# EasyEDA Pro project 第十二届蓝桥杯EDA国赛真题.eprj, schematic user
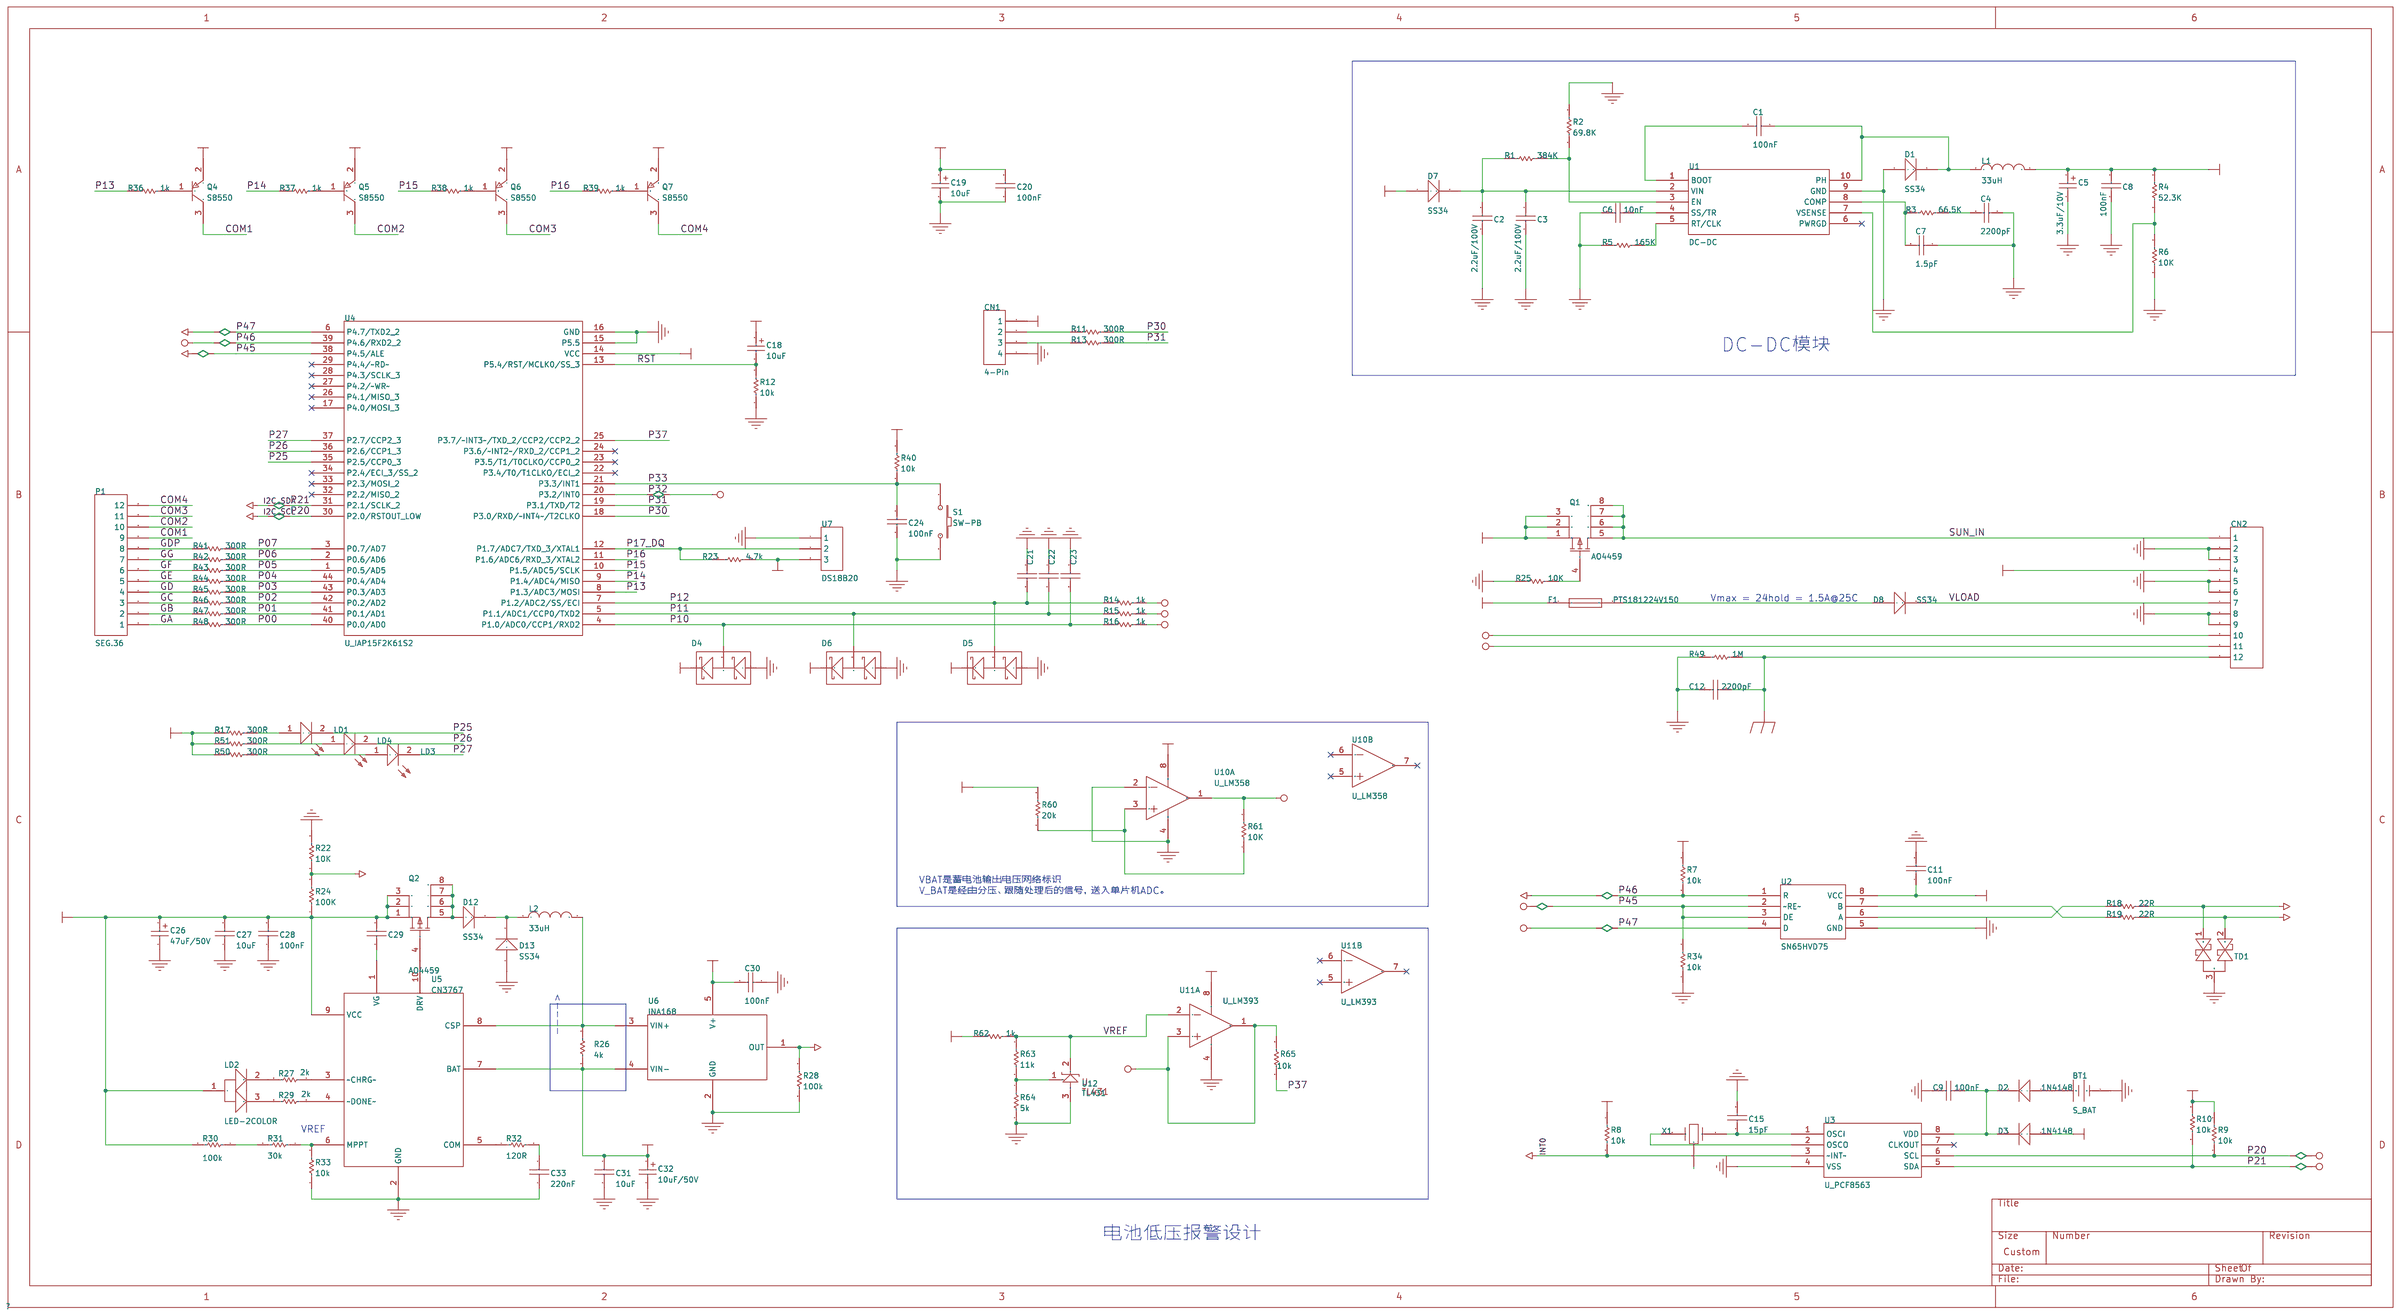
[diagram p0: schematic sheet]

## Parts
BT1  S_BAT  [S_BAT-CR1220]
C1  100nF  [C_C0805]
C2  2.2uF/100V  [C_C1812]
C3  2.2uF/100V  [C_C1812]
C4  2200pF  [C_C0805]
C5  47uF  [C_C1812]
C6  10nF  [C_C0805]
C7  1.5pF  [C_C0805]
C8  100nF  [C_C0805]
C9  100nF  [C_C0805]
C11  100nF  [C_C0805]
C12  2200pF  [C_CAP-10]
C15  15pF  [C_C0805]
C18  47uF  [C_C1206]
C19  47uF  [C_C1206]
C20  100nF  [C_C0805]
C21  100nF  [C_C0805]
C22  100nF  [C_C0805]
C23  100nF  [C_C0805]
C24  100nF  [C_C0805]
C26  47uF  [C_CAP-6X7]
C27  10uF  [C_C1206]
C28  100nF  [C_C0805]
C29  100nF  [C_C0805]
C30  100nF  [C_C0805]
C31  10uF  [C_C1206]
C32  47uF  [C_CAP-5X5]
C33  220nF  [C_C0805]
CN1  4-Pin  [SIP-4]
CN2  Header 12H  [SIP12-3.81]
D1  SS34  [D_DIO-SMA]
D2  1N4148  [D_DIO-SMT]
D3  1N4148  [D_DIO-SMT]
D4  BAT54S  [SOP-SOT23-3]
D5  BAT54S  [SOP-SOT23-3]
D6  BAT54S  [SOP-SOT23-3]
D7  SS34  [D_DIO-SMA]
D8  SS34  [D_DIO-SMA]
D12  SS34  [D_DIO-SMA]
D13  SS34  [D_DIO-SMA]
F1  PTS181224V150  [F_Fuse_1812]
L1  100uH  [L_L7X7X4]
L2  100uH  [L_L12x12]
LD1  Red  [D_LED-3MM]
LD2  LED-2COLOR  [共阳极双色LED]
LD3  Red  [D_LED-3MM]
LD4  Red  [D_LED-3MM]
P1  SEG.36  [D_SEG-0.56]
Q1  AO4459  [SOP-8]
Q2  AO4459  [SOP-8]
Q4  S8550  [SOP-SOT23-3]
Q5  S8550  [SOP-SOT23-3]
Q6  S8550  [SOP-SOT23-3]
Q7  S8550  [SOP-SOT23-3]
R1  1K  [R_R0805]
R2  1K  [R_R0805]
R3  1K  [R_R0805]
R4  1K  [R_R0805]
R5  1K  [R_R0805]
R6  1K  [R_R0805]
R7  1K  [R_R0805]
R8  1K  [R_R0805]
R9  1K  [R_R0805]
R10  1K  [R_R0805]
R11  1K  [R_R0805]
R12  1K  [R_R0805]
R13  1K  [R_R0805]
R14  1K  [R_R0805]
R15  1K  [R_R0805]
R16  1K  [R_R0805]
R17  1K  [R_R0805]
R18  1K  [R_R0805]
R19  1K  [R_R0805]
R22  1K  [R_R0805]
R23  1K  [R_R0805]
R24  1K  [R_R0805]
R25  1K  [R_R0805]
R26  1K  [R_R2512]
R27  1K  [R_R0805]
R28  1K  [R_R0805]
R29  1K  [R_R0805]
R30  1K  [R_R0805]
R31  1K  [R_R0805]
R32  1K  [R_R0805]
R33  1K  [R_R0805]
R34  1K  [R_R0805]
R36  1K  [R_R0805]
R37  1K  [R_R0805]
R38  1K  [R_R0805]
R39  1K  [R_R0805]
R40  1K  [R_R0805]
R41  1K  [R_R0805]
R42  1K  [R_R0805]
R43  1K  [R_R0805]
R44  1K  [R_R0805]
R45  1K  [R_R0805]
R46  1K  [R_R0805]
R47  1K  [R_R0805]
R48  1K  [R_R0805]
R49  1K  [R_R0805]
R50  1K  [R_R0805]
R51  1K  [R_R0805]
R60  1K  [R_R0805]
R61  1K  [R_R0805]
R62  1K  [R_R0805]
R63  1K  [R_R0805]
R64  1K  [R_R0805]
R65  1K  [R_R0805]
S1  SW-PB  [SW_BTN4 - LYING]
TD1  CDSOT23-SM712  [SOP-SOT23-3]
U1  DC-DC  [SMD-10]
U2  SN65HVD75  [SOP-8]
U3  U_PCF8563  [SOP-8]
U4  U_IAP15F2K61S2  [QFP-LQFP-44]
U5  CN3767  [SOP-SSOP-10]
U6  INA168  [SOP-SOT23-5]
U7  DS18B20  [S_DS18B20]
U10  U_LM358  [SOP-8]  (sections 1,2)
U11  U_LM393  [SOP-8]  (sections 1,2)
U12  TL431  [SOP-SOT23-3]
X1  32.768kHz  [XTAL-DT38]

## Library data of the parts
BT1 = S_BAT: BATTERY; 中文名称: 电池座; Library Name: 2017.12.04
C1 C8 C11 C21-C23 = 100nF: Capacitor; 中文名称: 贴片电容; Design Item ID: CAP; Library Name: 2014
C2 C3 = 2.2uF/100V: Capacitor; Design Item ID: CAP; Library Name: 2014
C4 = 2200pF: CAP; 中文名称: 贴片电容; Design Item ID: CAP; Library Name: user
C5 = 3.3uF/10V: 瓷片电容; Published: 8-Jun-2000; Revision: July-2002: Re-released for DXP Platform.; Publisher: Altium Limited; 中文名称: 钽电容; Origin Footprint 1: C_C1206; Design Item ID: Cap Pol1; Library Name: user
C6 = 10nF: Capacitor; Design Item ID: CAP; Library Name: 2014
C7 = 1.5pF: Capacitor; Design Item ID: CAP; Library Name: 2014
C9 C20 C24 = 100nF: 电容; 中文名称: 贴片电容; Design Item ID: CAP; Library Name: 2014
C12 = 2200pF: CAP; 中文名称: 贴片电容; Design Item ID: CAP; Library Name: 2014
C15 = 15pF: Capacitor; Design Item ID: CAP; Library Name: 2014
C18 C19 = 10uF: 瓷片电容; Published: 8-Jun-2000; Revision: July-2002: Re-released for DXP Platform.; Publisher: Altium Limited; 中文名称: 钽电容; Design Item ID: Cap Pol1; Library Name: 2014
C26 = 47uF/50V: Polarized Capacitor (Radial); Published: 8-Jun-2000; Revision: July-2002: Re-released for DXP Platform.; Publisher: Altium Limited; 中文名称: 钽电容; Design Item ID: Cap Pol1; Library Name: 2014
C27 C31 = 10uF: CAP; 中文名称: 贴片电容; Design Item ID: CAP; Library Name: 2014
C28-C30 = 100nF: CAP; 中文名称: 贴片电容; Design Item ID: CAP; Library Name: 2014
C32 = 10uF/50V: Polarized Capacitor (Radial); Published: 8-Jun-2000; Revision: July-2002: Re-released for DXP Platform.; Publisher: Altium Limited; 中文名称: 钽电容; Design Item ID: Cap Pol1; Library Name: 2014
C33 = 220nF: CAP; 中文名称: 贴片电容; Design Item ID: CAP; Library Name: 2014
CN1 = 4-Pin: Header, 4-Pin; Revision: 17-Jul-2002: Re-released for DXP Platform.; Publisher: Altium Limited; 中文名称: 4P排针; Design Item ID: J_CN4; Library Name: 2017.10.10
CN2 = Header 12H: Header, 12-Pin, Right Angle; LatestRevisionDate: 17-Jul-2002; LatestRevisionNote: Re-released for DXP Platform.; Publisher: Altium Limited; Library Name: Miscellaneous Connectors
D1 D7 = SS34: Published: 8-Jun-2000; Revision: July-2002: Re-released for DXP Platform.; Publisher: Altium Limited; Code - JEDEC: DO-214-AA; Design Item ID: DIODE; Library Name: user
D2 D3 = 1N4148: DIODE; Published: 8-Jun-2000; Revision: July-2002: Re-released for DXP Platform.; Publisher: Altium Limited; Code - JEDEC: DO-214-AA; 中文名称: 二极管; Design Item ID: D_D; Library Name: 2017.12.04
D4-D6 = BAT54S: DIODE; 中文名称: 双二极管; Design Item ID: D_BAT54S; Library Name: MSCH
D8 D12 D13 = SS34: Published: 8-Jun-2000; Revision: July-2002: Re-released for DXP Platform.; Publisher: Altium Limited; Code - JEDEC: DO-214-AA; Design Item ID: DIODE; Library Name: 2014
F1 = PTS181224V150: Fuse; Published: 8-Jun-2000; LatestRevisionDate: 17-Jul-2002; LatestRevisionNote: Re-released for DXP Platform.; PackageReference: PIN-W2/E2.8; Publisher: Altium Limited; Design Item ID: Fuse 1; Library Name: Miscellaneous Devices
L1 L2 = 33uH: Inductor; Published: 8-Jun-2000; Revision: July-2002: Re-released for DXP Platform.; Publisher: Altium Limited; Design Item ID: Inductor; Library Name: 2014
LD1 LD3 LD4 = Red: Typical RED, GREEN, YELLOW, AMBER GaAs LED; Published: 8-Jun-2000; Revision: July-2002: Re-released for DXP Platform.; Publisher: Altium Limited; Design Item ID: LED2; Library Name: 2014
LD2 = LED-2COLOR: Library Name: PCB_CN3767_SCH
P1 = SEG.36: Header, 12-Pin; LatestRevisionDate: 17-Jul-2002; LatestRevisionNote: Re-released for DXP Platform.; Publisher: Altium Limited; Design Item ID: Header 12; Library Name: Miscellaneous Connectors
Q1 Q2 = AO4459: PMOS; 中文名称: P沟道场效应管; Design Item ID: D_PMOS_1; Library Name: Company-library
Q4-Q7 = S8550: PNP General Purpose Amplifier; Published: 8-Jun-2000; LatestRevisionDate: 15-Jan-2003; LatestRevisionNote: PCB Footprint &apos;BCY-W3/D4.7&apos; replaced; DatasheetVersion: 1997; PackageVersion: Sep-1998; PackageReference: TO-92A; Publisher: Altium Limited; Code_JEDEC: TO-92A; ComponentLink1Description: Manufacturer Link; ComponentLink1URL: http://www.fairchildsemi.com/; ComponentLink2Description: Datasheet; ComponentLink2URL: http://www.fairchildsemi.com/ds/2N%2F2N3906.pdf; Design Item ID: 2N3906; Library Name: Miscellaneous Devices
R1 = 384K: Resistor; Published: 8-Jun-2000; Revision: July-2002: Re-released for DXP Platform.; Publisher: Altium Limited; Design Item ID: Res1; Library Name: 2014
R2 = 69.8K: Resistor; Published: 8-Jun-2000; Revision: July-2002: Re-released for DXP Platform.; Publisher: Altium Limited; Design Item ID: Res1; Library Name: 2014
R3 = 66.5K: Resistor; Published: 8-Jun-2000; Revision: July-2002: Re-released for DXP Platform.; Publisher: Altium Limited; Design Item ID: Res1; Library Name: 2014
R4 = 52.3K: Resistor; Published: 8-Jun-2000; Revision: July-2002: Re-released for DXP Platform.; Publisher: Altium Limited; Design Item ID: Res1; Library Name: 2014
R5 = 165K: Resistor; Published: 8-Jun-2000; Revision: July-2002: Re-released for DXP Platform.; Publisher: Altium Limited; Design Item ID: Res1; Library Name: 2014
R6-R10 R22 R25 R33 R34 R65 = 10K: Resistor; Published: 8-Jun-2000; Revision: July-2002: Re-released for DXP Platform.; Publisher: Altium Limited; Design Item ID: Res1; Library Name: 2014
R11 R13 = 300R: Resistor; Published: 8-Jun-2000; Revision: July-2002: Re-released for DXP Platform.; Publisher: Altium Limited; 中文名称: 电阻; Design Item ID: R_RES; Library Name: 2017.10.10
R12 R40 = 10K: 电阻; Published: 8-Jun-2000; Revision: July-2002: Re-released for DXP Platform.; Publisher: Altium Limited; Design Item ID: Res1; Library Name: 2014
R14-R16 R62 = 1k: Resistor; Published: 8-Jun-2000; Revision: July-2002: Re-released for DXP Platform.; Publisher: Altium Limited; 中文名称: 电阻; Design Item ID: R_RES; Library Name: 2017.10.10
R17 R50 R51 = 300R: RES; Published: 8-Jun-2000; Revision: July-2002: Re-released for DXP Platform.; Publisher: Altium Limited; Design Item ID: Res1; Library Name: 2014
R18 R19 = 22R: Resistor; Published: 8-Jun-2000; Revision: July-2002: Re-released for DXP Platform.; Publisher: Altium Limited; Design Item ID: Res1; Library Name: 2014
R23 = 4.7k: 电阻; Published: 8-Jun-2000; Revision: July-2002: Re-released for DXP Platform.; Publisher: Altium Limited; Design Item ID: Res1; Library Name: 2014
R24 R28 R30 = 100K: Resistor; Published: 8-Jun-2000; Revision: July-2002: Re-released for DXP Platform.; Publisher: Altium Limited; Design Item ID: Res1; Library Name: 2014
R26 = 4k: Resistor; Published: 8-Jun-2000; Revision: July-2002: Re-released for DXP Platform.; Publisher: Altium Limited; Design Item ID: Res1; Library Name: 2014
R27 R29 = 2k: RES; Published: 8-Jun-2000; Revision: July-2002: Re-released for DXP Platform.; Publisher: Altium Limited; Design Item ID: Res1; Library Name: 2014
R31 = 30k: Resistor; Published: 8-Jun-2000; Revision: July-2002: Re-released for DXP Platform.; Publisher: Altium Limited; Design Item ID: Res1; Library Name: 2014
R32 = 120R: Resistor; Published: 8-Jun-2000; Revision: July-2002: Re-released for DXP Platform.; Publisher: Altium Limited; Design Item ID: Res1; Library Name: 2014
R36-R39 = 1k: Resistor; Published: 8-Jun-2000; Revision: July-2002: Re-released for DXP Platform.; Publisher: Altium Limited; Design Item ID: Res1; Library Name: 2014
R41-R48 = 300R: Resistor; Published: 8-Jun-2000; Revision: July-2002: Re-released for DXP Platform.; Publisher: Altium Limited; Design Item ID: Res1; Library Name: 2014
R49 = 1M: Resistor; Published: 8-Jun-2000; Revision: July-2002: Re-released for DXP Platform.; Publisher: Altium Limited; Design Item ID: Res1; Library Name: 2014
R60 = 20k: Resistor; Published: 8-Jun-2000; Revision: July-2002: Re-released for DXP Platform.; Publisher: Altium Limited; 中文名称: 电阻; Design Item ID: R_RES; Library Name: 2017.10.10
R61 = 10K: Resistor; Published: 8-Jun-2000; Revision: July-2002: Re-released for DXP Platform.; Publisher: Altium Limited; 中文名称: 电阻; Design Item ID: R_RES; Library Name: 2017.10.10
R63 = 11k: Resistor; Published: 8-Jun-2000; Revision: July-2002: Re-released for DXP Platform.; Publisher: Altium Limited; 中文名称: 电阻; Design Item ID: R_RES; Library Name: 2017.10.10
R64 = 5k: Resistor; Published: 8-Jun-2000; Revision: July-2002: Re-released for DXP Platform.; Publisher: Altium Limited; 中文名称: 电阻; Design Item ID: R_RES; Library Name: 2017.10.10
S1 = SW-PB: Switch; Published: 24-Mar-1999; LatestRevisionDate: 17-Jul-2002; LatestRevisionNote: Re-released for DXP Platform.; PackageReference: SPST-2; Publisher: Altium Limited; Library Name: Miscellaneous Devices
TD1 = CDSOT23-SM712: Design Item ID: TVS_2; Library Name: 2014
U1 = DC-DC: Library Name: user
U2 = SN65HVD75: Design Item ID: ADM3485; Library Name: 2014
U3 = U_PCF8563: IC; 中文名称: 实时时钟芯片; Library Name: 2017.12.04
U4 = U_IAP15F2K61S2: MCU; 中文名称: STC15系列单片机; Library Name: MSCH
U5 = CN3767: IC; 中文名称: 蓄电池充电控制芯片; Library Name: 2017.10.10
U6 = INA168: IC; 中文名称: 电流监控芯片; Design Item ID: 1NA168; Library Name: 2017.10.10
U7 = DS18B20: Header, 3-Pin; Revision: 17-Jul-2002: Re-released for DXP Platform.; Publisher: Altium Limited; 中文名称: 3P排针; Design Item ID: J_CN3; Library Name: 2017.12.04
U10 = U_LM358: 2运放; Library Name: Altium
U11 = U_LM393: 2运放; Library Name: Altium
U12 = TL431: sim: true
X1 = 32.768kHz: CRYSTAL; 中文名称: 晶振; Design Item ID: CRY_2; Library Name: PCB_CN3767_SCH

## Nets
GND: BT1.1(GND) C2.2 C3.2 C4.2 C5.2 C6.2 C7.1 C8.2 C9.2 C11.2 C12.1 C15.2 C19.2 C20.2 C21.1 C22.1 C23.1 C24.2 C26.2 C27.1 C28.1 C30.1 C31.2 C32.2 C33.1 CN1.4 CN2.2 CN2.3 CN2.5 CN2.6 CN2.8 CN2.9 D1.1(A) D4.1(A) D5.1(A) D6.1(A) D13.1(A) R2.1 R5.1 R6.2 R12.1 R22.2 R25.2 R28.2 R33.1 R34.1 R49.2 R64.2 S1.2 TD1.3(CATHODE) U1.9(GND) U2.5(GND) U3.4(VSS) U4.15(P5.5) U4.16(GND) U5.2(GND) U6.2(GND) U7.1 U10.2(IN1-) U10.4(GND) U11.4(GND) U12.3(A)
VBAT: C31.1 C32.1 CN2.4 D7.1(A) F1.1 R26.2 R60.2 R62.1 U5.7(BAT) U6.4(VIN-) U10.8(VCC)
VDD: C5.1 C8.1 C11.1 C18.1 C19.1 C20.1 C30.2 CN1.1 D3.1(A) D4.2(K) D5.2(K) D6.2(K) L1.2 Q4.2(E) Q5.2(E) Q6.2(E) Q7.2(E) R4.1 R7.2 R8.1 R9.2 R10.2 R17.1 R23.1 R40.2 R50.1 R51.1 U2.8(VCC) U4.14(VCC) U6.5(V+) U7.3 U11.8(VCC)
VIN: C26.1 C27.2 C28.2 C29.1 LD2.1 Q1.1(S) Q1.2(S) Q1.3(S) Q2.1(S) Q2.2(S) Q2.3(S) R24.1 R30.2 U5.9(VCC)
0: X1.0
C_BAT: R14.2 R28.1 U6.1(OUT)
COM1: P1.9 Q4.3(C)
COM2: P1.10 Q5.3(C)
COM3: P1.11 Q6.3(C)
COM4: P1.12 Q7.3(C)
GA: P1.1 R48.1
GB: P1.2 R47.1
GC: P1.3 R46.1
GD: P1.4 R45.1
GDP: P1.8 R41.1
GE: P1.5 R44.1
GF: P1.6 R43.1
GG: P1.7 R42.1
I2C_SCL: R9.1 U3.6(SCL) U4.30(P2.0/RSTOUT_LOW)
I2C_SDA: R10.1 U3.5(SDA) U4.31(P2.1/SCLK_2)
INT0: R8.2 U3.3(~INT~) U4.20(P3.2/INT0)
MCU_RX2: R7.1 U2.1(R) U4.39(P4.6/RXD2_2)
MCU_TX2: U2.4(D) U4.6(P4.7/TXD2_2)
P00: R48.2 U4.40(P0.0/AD0)
P01: R47.2 U4.41(P0.1/AD1)
P02: R46.2 U4.42(P0.2/AD2)
P03: R45.2 U4.43(P0.3/AD3)
P04: R44.2 U4.44(P0.4/AD4)
P05: R43.2 U4.1(P0.5/AD5)
P06: R42.2 U4.2(P0.6/AD6)
P07: R41.2 U4.3(P0.7/AD7)
P10: C23.2 D4.3(C) R16.1 U4.4(P1.0/ADC0/CCP1/RXD2)
P11: C22.2 D6.3(C) R15.1 U4.5(P1.1/ADC1/CCP0/TXD2)
P12: C21.2 D5.3(C) R14.1 U4.7(P1.2/ADC2/SS/ECI)
P13: R36.1 U4.8(P1.3/ADC3/MOSI)
P14: R37.1 U4.9(P1.4/ADC4/MISO)
P15: R38.1 U4.10(P1.5/ADC5/SCLK)
P16: R39.1 U4.11(P1.6/ADC6/RXD_3/XTAL2)
P17_DQ: R23.2 U4.12(P1.7/ADC7/TXD_3/XTAL1) U7.2
P25: LD1.2(K) U4.35(P2.5/CCP0_3)
P26: LD4.2(K) U4.36(P2.6/CCP1_3)
P27: LD3.2(K) U4.37(P2.7/CCP2_3)
P30: R11.2 U4.18(P3.0/RXD/~INT4~/T2CLKO)
P31: R13.2 U4.19(P3.1/TXD/T2)
P33: C24.1 R40.1 S1.1 U4.21(P3.3/INT1)
P37: R65.1 U4.25(P3.7/~INT3~/TXD_2/CCP2/CCP2_2)
PE: C12.2 CN2.12 R49.1
RS485_A: CN2.10 R18.1 TD1.1(CATHODE)
RS485_B: CN2.11 R19.1 TD1.2(CATHODE)
RS485_DIR: R34.2 U2.2(~RE~) U2.3(DE) U4.38(P4.5/ALE)
RST: C18.2 R12.2 U4.13(P5.4/RST/MCLK0/SS_3)
SUN_IN: CN2.1 Q1.5(D) Q1.6 Q1.7 Q1.8
V_BAT: R16.2 R61.2 R65.2 U10.1(OUT1) U11.1(OUT1) U11.3(IN1+)
V_SUN: R15.2 R22.1 R24.2
VLOAD: CN2.7 D8.2(K)
VREF: R62.2 R63.1 U11.2(IN1-) U12.2(K)
$1N2053: Q1.4(G) R25.1
$1N2057: D8.1(A) F1.2
$1N2084: CN1.2 R11.1
$1N2093: CN1.3 R13.1
$1N2207: LD1.1(A) R17.2
$1N2215: LD4.1(A) R51.2
$1N2216: LD3.1(A) R50.2
$1N2229: R18.2 U2.6(A)
$1N2230: R19.2 U2.7(B)
$1N2239: C9.1 D2.2(K) D3.2(K) U3.8(VDD)
$1N2244: C15.1 U3.1(OSCI) X1.2
$1N2247: U3.2(OSCO) X1.1
$1N2268: D12.1(A) Q2.5(D) Q2.6 Q2.7 Q2.8
$1N2271: D12.2(K) D13.2(K) L2.1
$1N2272: C29.2 U5.1(VG)
$1N2274: L2.2 R26.1 U5.8(CSP) U6.3(VIN+)
$1N2283: R30.1 R31.2
$1N2284: R31.1 R33.2 U5.6(MPPT)
$1N2285: C33.2 R32.2
$1N2295: R63.2 R64.1 U12.1(R)
$1N2301: C2.1 C3.1 D7.2(K) R1.2 U1.2(VIN)
$1N2302: R1.1 R2.2 U1.3(EN)
$1N2307: C6.1 U1.4(SS/TR)
$1N2310: R5.2 U1.5(RT/CLK)
$1N2313: C1.2 U1.1(BOOT)
$1N2314: C1.1 D1.2(K) L1.1 U1.10(PH)
$1N2318: C7.2 R3.2 U1.8(COMP)
$1N2319: C4.1 R3.1
$1N2328: R4.2 R6.1 U1.7(VSENSE)
$1N2333: R60.1 R61.1 U10.3(IN1+)
$1N2421: Q4.1(B) R36.2
$1N2422: Q5.1(B) R37.2
$1N2423: Q6.1(B) R38.2
$1N2424: Q7.1(B) R39.2
$1N2459: BT1.2(GND) D2.1(A)
$1N2470: Q2.4(G) U5.10(DRV)
$1N2475: LD2.2 R27.2
$1N2476: LD2.3 R29.2
$1N2477: R27.1 U5.3(~CHRG~)
$1N2478: R29.1 U5.4(~DONE~)
$1N2479: R32.1 U5.5(COM)

Not connected (* = marked no-connect by the designer): U1 6(PWRGD)*; U3 7(CLKOUT)*; U4 17(P4.0/MOSI_3)* 22(P3.4/T0/T1CLKO/ECI_2)* 23(P3.5/T1/T0CLKO/CCP0_2)* 24(P3.6/~INT2~/RXD_2/CCP1_2)* 26(P4.1/MISO_3)* 27(P4.2/~WR~)* 28(P4.3/SCLK_3)* 29(P4.4/~RD~)* 32(P2.2/MISO_2)* 33(P2.3/MOSI_2)* 34(P2.4/ECI_3/SS_2)*; U10 5(IN1+)* 6(IN1-)* 7(OUT1)*; U11 5(IN1+)* 6(IN1-)* 7(OUT1)*

## Notes on the sheet
- DC-DC模块
- Vmax = 24
- Ihold = 1.5A@25C
- VBAT是蓄电池输出电压网络标识
- V_BAT是经由分压、跟随处理后的信号，送入单片机ADC。
- ---->
- VREF
- 电池低压报警设计
